# Altium schematic sheet IMX8_PHY.SchDoc
size 594 x 420 mm; SheetNumber: 9; SheetTotal: 20
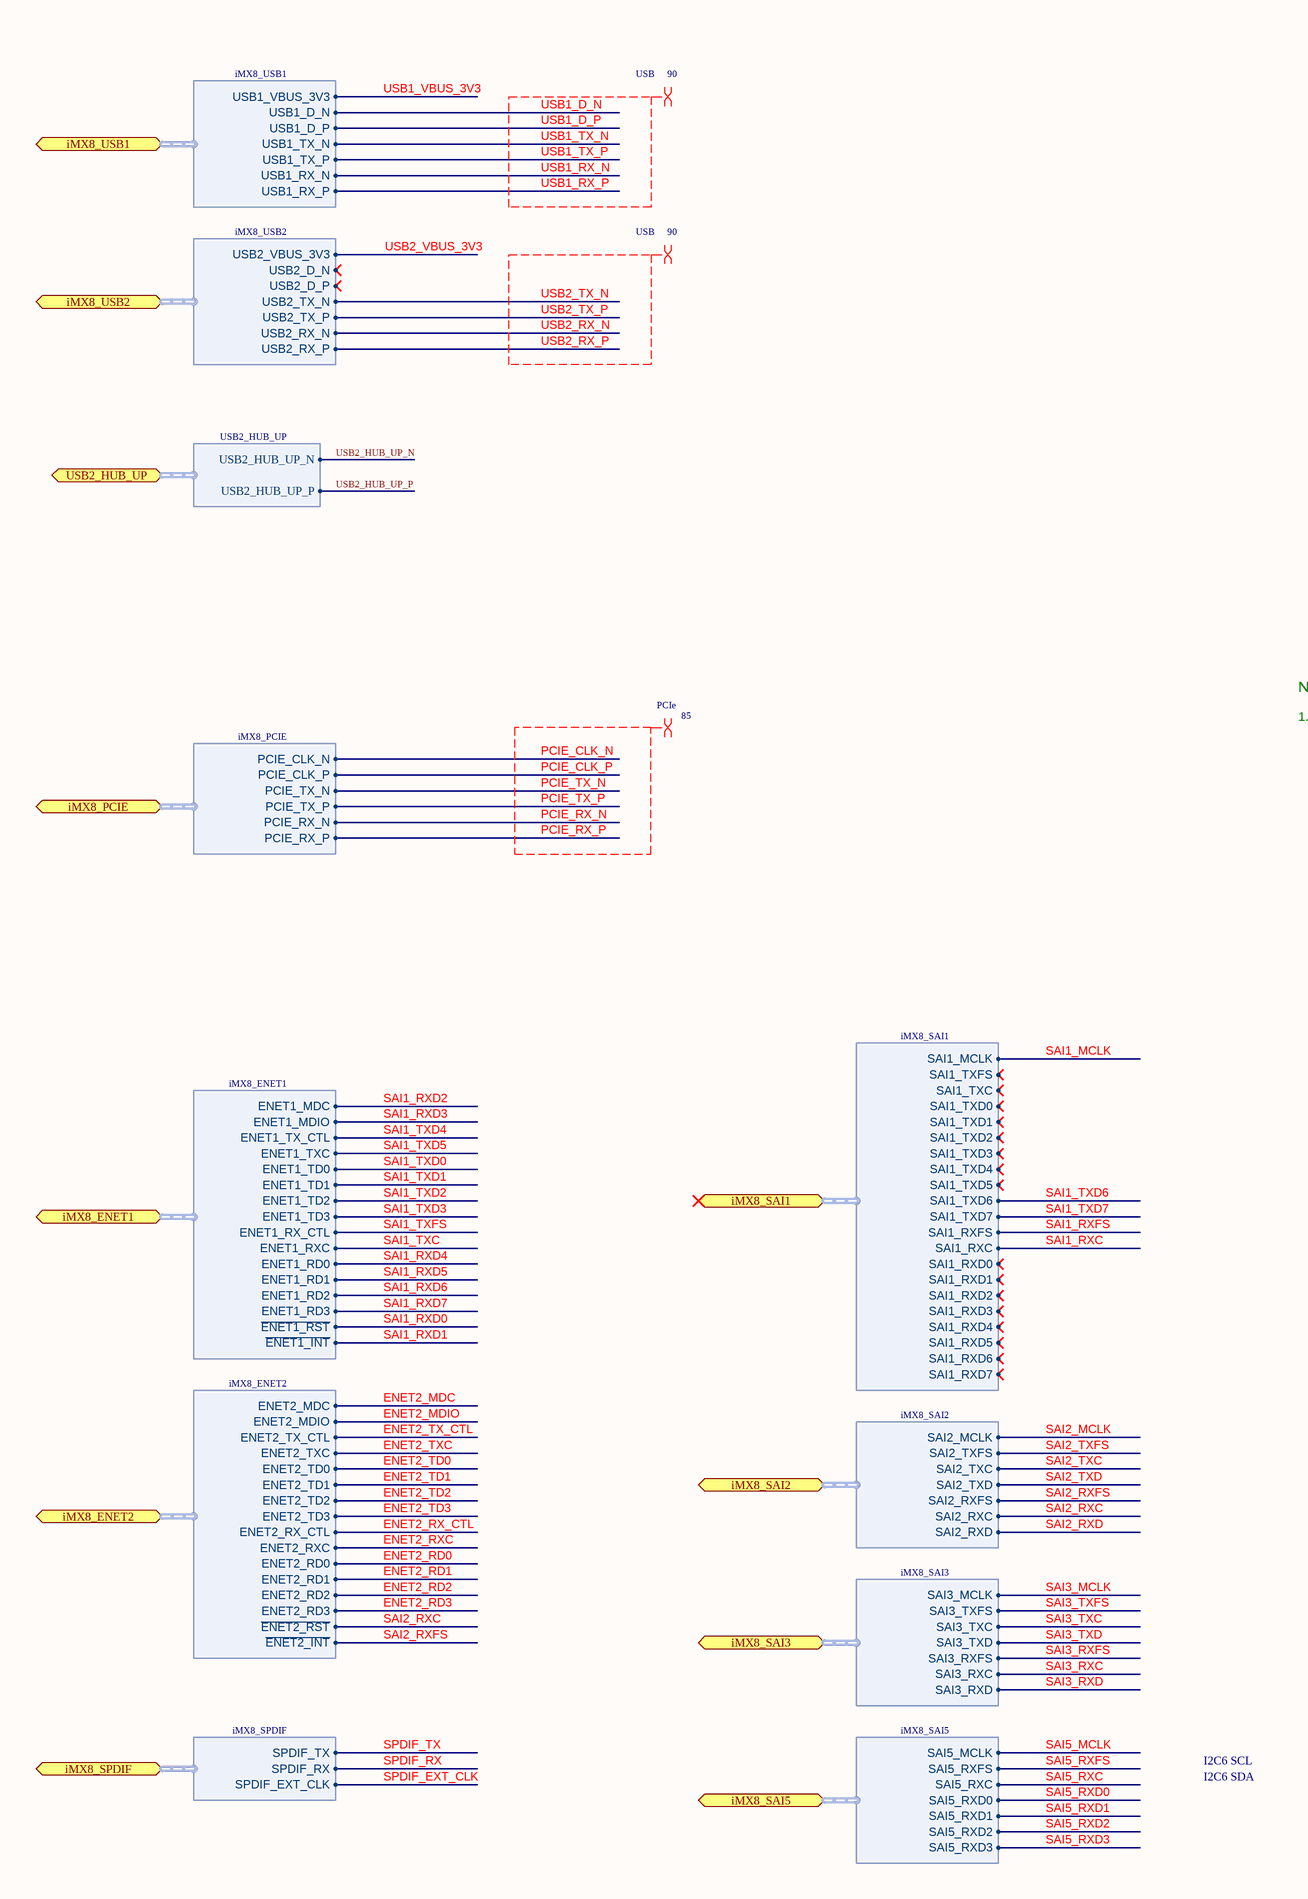
[diagram p0: IMX8_PHY.SchDoc, left]
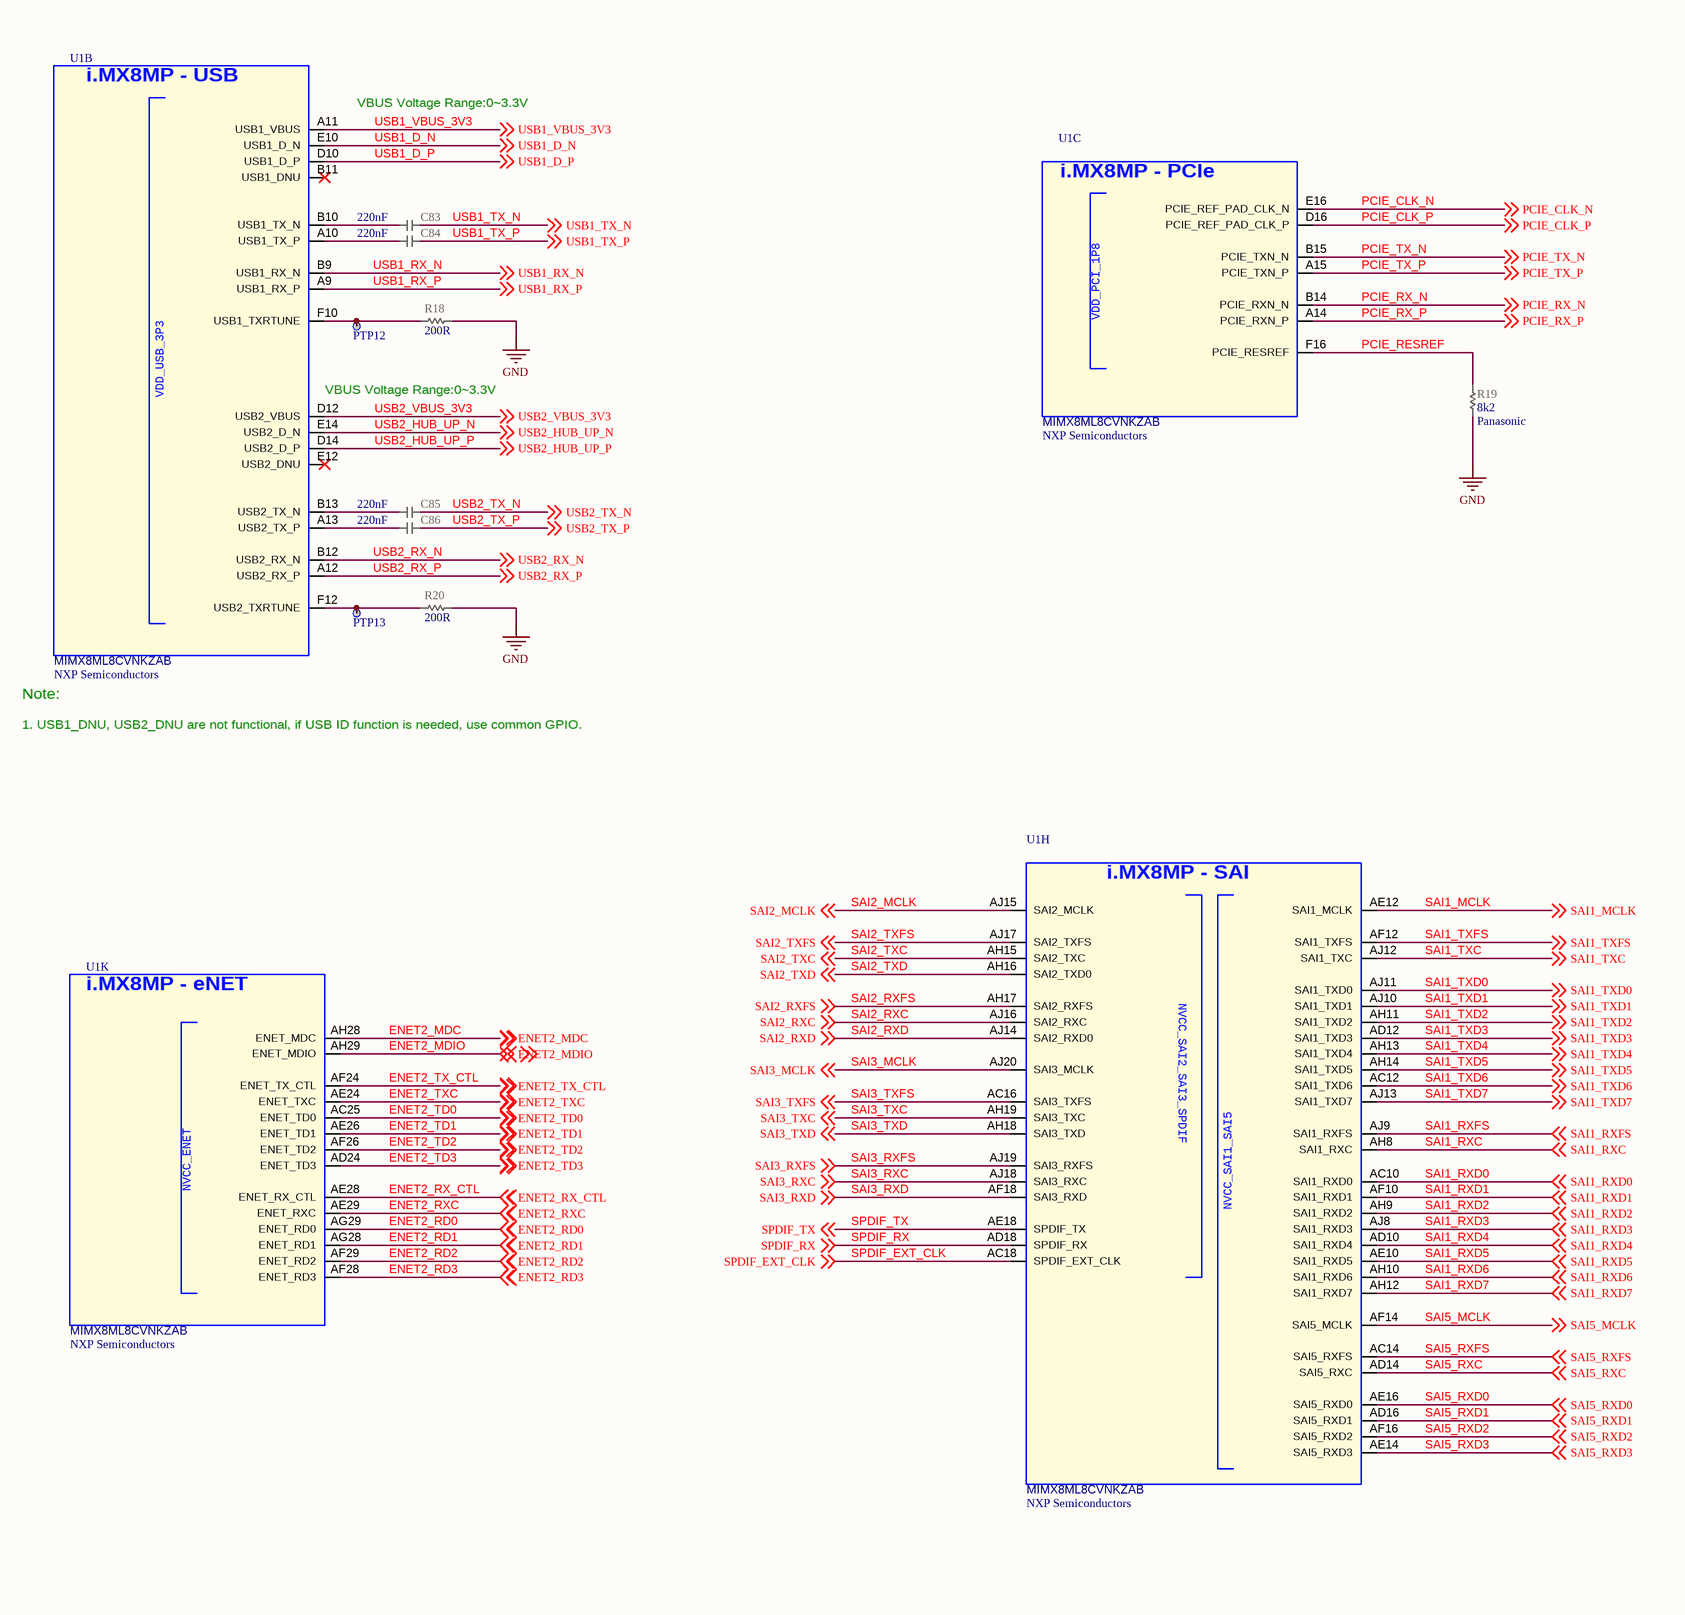
[diagram p1: IMX8_PHY.SchDoc, right]

## Parts
C83  value 220nF  [CAP_0201_UN1Q]  (hidden comment: CAP_0201_220n_10V_X6S)
C84  value 220nF  [CAP_0201_UN1Q]  (hidden comment: CAP_0201_220n_10V_X6S)
C85  value 220nF  [CAP_0201_UN1Q]  (hidden comment: CAP_0201_220n_10V_X6S)
C86  value 220nF  [CAP_0201_UN1Q]  (hidden comment: CAP_0201_220n_10V_X6S)
PTP12  PTP_0.4mm  [PTP_0.4mm]  (value not drawn)  (no BOM)
PTP13  PTP_0.4mm  [PTP_0.4mm]  (value not drawn)  (no BOM)
R18  value 200R  [RES_0201_UN1Q]  (hidden comment: RES_0201_200R)
R19  value 8k2  Manufacturer: Panasonic  [RES_0201_UN1Q]  (hidden comment: RES_0201_8k2)
R20  value 200R  [RES_0201_UN1Q]  (hidden comment: RES_0201_200R)
U1  Manufacturer: NXP Semiconductors  [BGA548C50P29X29_1500X1500X148]  (hidden comment: MIMX8ML8CVNKZAB)  (parts B,C,H,K of 15)

## Ports
iMX8_ENET1 (bidir, harness iMX8_ENET1), iMX8_ENET2 (bidir, harness iMX8_ENET2), iMX8_PCIE (bidir, harness iMX8_PCIE), iMX8_SAI1 (bidir, harness iMX8_SAI1), iMX8_SAI2 (bidir, harness iMX8_SAI2), iMX8_SAI3 (bidir, harness iMX8_SAI3), iMX8_SAI5 (bidir, harness iMX8_SAI5), iMX8_SPDIF (bidir, harness iMX8_SPDIF), iMX8_USB1 (bidir, harness iMX8_USB1), iMX8_USB2 (bidir, harness iMX8_USB2), USB2_HUB_UP (bidir, harness USB2_HUB_UP)

## Harnesses
iMX8_USB1: USB1_VBUS_3V3, USB1_D_N, USB1_D_P, USB1_TX_N, USB1_TX_P, USB1_RX_N, USB1_RX_P
iMX8_USB2: USB2_VBUS_3V3, USB2_D_N, USB2_D_P, USB2_TX_N, USB2_TX_P, USB2_RX_N, USB2_RX_P
USB2_HUB_UP: USB2_HUB_UP_P, USB2_HUB_UP_N
iMX8_ENET1: ENET1_MDC, ENET1_MDIO, ENET1_TX_CTL, ENET1_TXC, ENET1_TD0, ENET1_TD1, ENET1_TD2, ENET1_TD3, ENET1_RX_CTL, ENET1_RXC, ENET1_RD0, ENET1_RD1, ENET1_RD2, ENET1_RD3, ~{ENET1_RST}, ~{ENET1_INT}
iMX8_ENET2: ENET2_MDC, ENET2_MDIO, ENET2_TX_CTL, ENET2_TXC, ENET2_TD0, ENET2_TD1, ENET2_TD2, ENET2_TD3, ENET2_RX_CTL, ENET2_RXC, ENET2_RD0, ENET2_RD1, ENET2_RD2, ENET2_RD3, ~{ENET2_RST}, ~{ENET2_INT}
iMX8_PCIE: PCIE_CLK_N, PCIE_CLK_P, PCIE_TX_N, PCIE_TX_P, PCIE_RX_N, PCIE_RX_P
iMX8_SPDIF: SPDIF_TX, SPDIF_RX, SPDIF_EXT_CLK
iMX8_SAI2: SAI2_MCLK, SAI2_TXFS, SAI2_TXC, SAI2_TXD, SAI2_RXFS, SAI2_RXC, SAI2_RXD
iMX8_SAI3: SAI3_MCLK, SAI3_TXFS, SAI3_TXC, SAI3_TXD, SAI3_RXFS, SAI3_RXC, SAI3_RXD
iMX8_SAI5: SAI5_MCLK, SAI5_RXFS, SAI5_RXC, SAI5_RXD0, SAI5_RXD1, SAI5_RXD2, SAI5_RXD3
iMX8_SAI1: SAI1_MCLK, SAI1_TXFS, SAI1_TXC, SAI1_TXD0, SAI1_TXD1, SAI1_TXD2, SAI1_TXD3, SAI1_TXD4, SAI1_TXD5, SAI1_TXD6, SAI1_TXD7, SAI1_RXFS, SAI1_RXC, SAI1_RXD0, SAI1_RXD1, SAI1_RXD2, SAI1_RXD3, SAI1_RXD4, SAI1_RXD5, SAI1_RXD6, SAI1_RXD7

## Nets
GND: R18.1 R19.1 R20.1
ENET2_MDC: U1.AH28(ENET_MDC) ; off-sheet ENET2_MDC, port iMX8_ENET2.ENET2_MDC
ENET2_MDIO: U1.AH29(ENET_MDIO) ; off-sheet ENET2_MDIO, port iMX8_ENET2.ENET2_MDIO
ENET2_RD0: U1.AG29(ENET_RD0) ; off-sheet ENET2_RD0, port iMX8_ENET2.ENET2_RD0
ENET2_RD1: U1.AG28(ENET_RD1) ; off-sheet ENET2_RD1, port iMX8_ENET2.ENET2_RD1
ENET2_RD2: U1.AF29(ENET_RD2) ; off-sheet ENET2_RD2, port iMX8_ENET2.ENET2_RD2
ENET2_RD3: U1.AF28(ENET_RD3) ; off-sheet ENET2_RD3, port iMX8_ENET2.ENET2_RD3
ENET2_RX_CTL: U1.AE28(ENET_RX_CTL) ; off-sheet ENET2_RX_CTL, port iMX8_ENET2.ENET2_RX_CTL
ENET2_RXC: U1.AE29(ENET_RXC) ; off-sheet ENET2_RXC, port iMX8_ENET2.ENET2_RXC
ENET2_TD0: U1.AC25(ENET_TD0) ; off-sheet ENET2_TD0, port iMX8_ENET2.ENET2_TD0
ENET2_TD1: U1.AE26(ENET_TD1) ; off-sheet ENET2_TD1, port iMX8_ENET2.ENET2_TD1
ENET2_TD2: U1.AF26(ENET_TD2) ; off-sheet ENET2_TD2, port iMX8_ENET2.ENET2_TD2
ENET2_TD3: U1.AD24(ENET_TD3) ; off-sheet ENET2_TD3, port iMX8_ENET2.ENET2_TD3
ENET2_TX_CTL: U1.AF24(ENET_TX_CTL) ; off-sheet ENET2_TX_CTL, port iMX8_ENET2.ENET2_TX_CTL
ENET2_TXC: U1.AE24(ENET_TXC) ; off-sheet ENET2_TXC, port iMX8_ENET2.ENET2_TXC
PCIE_CLK_N: U1.E16(PCIE_REF_PAD_CLK_N) ; off-sheet PCIE_CLK_N, port iMX8_PCIE.PCIE_CLK_N
PCIE_CLK_P: U1.D16(PCIE_REF_PAD_CLK_P) ; off-sheet PCIE_CLK_P, port iMX8_PCIE.PCIE_CLK_P
PCIE_RESREF: R19.2 U1.F16(PCIE_RESREF)
PCIE_RX_N: U1.B14(PCIE_RXN_N) ; off-sheet PCIE_RX_N, port iMX8_PCIE.PCIE_RX_N
PCIE_RX_P: U1.A14(PCIE_RXN_P) ; off-sheet PCIE_RX_P, port iMX8_PCIE.PCIE_RX_P
PCIE_TX_N: U1.B15(PCIE_TXN_N) ; off-sheet PCIE_TX_N, port iMX8_PCIE.PCIE_TX_N
PCIE_TX_P: U1.A15(PCIE_TXN_P) ; off-sheet PCIE_TX_P, port iMX8_PCIE.PCIE_TX_P
SAI1_MCLK: U1.AE12(SAI1_MCLK) ; off-sheet SAI1_MCLK, port iMX8_SAI1.SAI1_MCLK
SAI1_RXC: U1.AH8(SAI1_RXC) ; off-sheet SAI1_RXC, port iMX8_SAI1.SAI1_RXC
SAI1_RXD0: U1.AC10(SAI1_RXD0) ; off-sheet SAI1_RXD0, port iMX8_ENET1.~{ENET1_RST}
SAI1_RXD1: U1.AF10(SAI1_RXD1) ; off-sheet SAI1_RXD1, port iMX8_ENET1.~{ENET1_INT}
SAI1_RXD2: U1.AH9(SAI1_RXD2) ; off-sheet SAI1_RXD2, port iMX8_ENET1.ENET1_MDC
SAI1_RXD3: U1.AJ8(SAI1_RXD3) ; off-sheet SAI1_RXD3, port iMX8_ENET1.ENET1_MDIO
SAI1_RXD4: U1.AD10(SAI1_RXD4) ; off-sheet SAI1_RXD4, port iMX8_ENET1.ENET1_RD0
SAI1_RXD5: U1.AE10(SAI1_RXD5) ; off-sheet SAI1_RXD5, port iMX8_ENET1.ENET1_RD1
SAI1_RXD6: U1.AH10(SAI1_RXD6) ; off-sheet SAI1_RXD6, port iMX8_ENET1.ENET1_RD2
SAI1_RXD7: U1.AH12(SAI1_RXD7) ; off-sheet SAI1_RXD7, port iMX8_ENET1.ENET1_RD3
SAI1_RXFS: U1.AJ9(SAI1_RXFS) ; off-sheet SAI1_RXFS, port iMX8_SAI1.SAI1_RXFS
SAI1_TXC: U1.AJ12(SAI1_TXC) ; off-sheet SAI1_TXC, port iMX8_ENET1.ENET1_RXC
SAI1_TXD0: U1.AJ11(SAI1_TXD0) ; off-sheet SAI1_TXD0, port iMX8_ENET1.ENET1_TD0
SAI1_TXD1: U1.AJ10(SAI1_TXD1) ; off-sheet SAI1_TXD1, port iMX8_ENET1.ENET1_TD1
SAI1_TXD2: U1.AH11(SAI1_TXD2) ; off-sheet SAI1_TXD2, port iMX8_ENET1.ENET1_TD2
SAI1_TXD3: U1.AD12(SAI1_TXD3) ; off-sheet SAI1_TXD3, port iMX8_ENET1.ENET1_TD3
SAI1_TXD4: U1.AH13(SAI1_TXD4) ; off-sheet SAI1_TXD4, port iMX8_ENET1.ENET1_TX_CTL
SAI1_TXD5: U1.AH14(SAI1_TXD5) ; off-sheet SAI1_TXD5, port iMX8_ENET1.ENET1_TXC
SAI1_TXD6: U1.AC12(SAI1_TXD6) ; off-sheet SAI1_TXD6, port iMX8_SAI1.SAI1_TXD6
SAI1_TXD7: U1.AJ13(SAI1_TXD7) ; off-sheet SAI1_TXD7, port iMX8_SAI1.SAI1_TXD7
SAI1_TXFS: U1.AF12(SAI1_TXFS) ; off-sheet SAI1_TXFS, port iMX8_ENET1.ENET1_RX_CTL
SAI2_MCLK: U1.AJ15(SAI2_MCLK) ; off-sheet SAI2_MCLK, port iMX8_SAI2.SAI2_MCLK
SAI2_RXC: U1.AJ16(SAI2_RXC) ; off-sheet SAI2_RXC, port iMX8_ENET2.~{ENET2_RST}, port iMX8_SAI2.SAI2_RXC
SAI2_RXD: U1.AJ14(SAI2_RXD0) ; off-sheet SAI2_RXD, port iMX8_SAI2.SAI2_RXD
SAI2_RXFS: U1.AH17(SAI2_RXFS) ; off-sheet SAI2_RXFS, port iMX8_ENET2.~{ENET2_INT}, port iMX8_SAI2.SAI2_RXFS
SAI2_TXC: U1.AH15(SAI2_TXC) ; off-sheet SAI2_TXC, port iMX8_SAI2.SAI2_TXC
SAI2_TXD: U1.AH16(SAI2_TXD0) ; off-sheet SAI2_TXD, port iMX8_SAI2.SAI2_TXD
SAI2_TXFS: U1.AJ17(SAI2_TXFS) ; off-sheet SAI2_TXFS, port iMX8_SAI2.SAI2_TXFS
SAI3_MCLK: U1.AJ20(SAI3_MCLK) ; off-sheet SAI3_MCLK, port iMX8_SAI3.SAI3_MCLK
SAI3_RXC: U1.AJ18(SAI3_RXC) ; off-sheet SAI3_RXC, port iMX8_SAI3.SAI3_RXC
SAI3_RXD: U1.AF18(SAI3_RXD) ; off-sheet SAI3_RXD, port iMX8_SAI3.SAI3_RXD
SAI3_RXFS: U1.AJ19(SAI3_RXFS) ; off-sheet SAI3_RXFS, port iMX8_SAI3.SAI3_RXFS
SAI3_TXC: U1.AH19(SAI3_TXC) ; off-sheet SAI3_TXC, port iMX8_SAI3.SAI3_TXC
SAI3_TXD: U1.AH18(SAI3_TXD) ; off-sheet SAI3_TXD, port iMX8_SAI3.SAI3_TXD
SAI3_TXFS: U1.AC16(SAI3_TXFS) ; off-sheet SAI3_TXFS, port iMX8_SAI3.SAI3_TXFS
SAI5_MCLK: U1.AF14(SAI5_MCLK) ; off-sheet SAI5_MCLK, port iMX8_SAI5.SAI5_MCLK
SAI5_RXC: U1.AD14(SAI5_RXC) ; off-sheet SAI5_RXC, port iMX8_SAI5.SAI5_RXC
SAI5_RXD0: U1.AE16(SAI5_RXD0) ; off-sheet SAI5_RXD0, port iMX8_SAI5.SAI5_RXD0
SAI5_RXD1: U1.AD16(SAI5_RXD1) ; off-sheet SAI5_RXD1, port iMX8_SAI5.SAI5_RXD1
SAI5_RXD2: U1.AF16(SAI5_RXD2) ; off-sheet SAI5_RXD2, port iMX8_SAI5.SAI5_RXD2
SAI5_RXD3: U1.AE14(SAI5_RXD3) ; off-sheet SAI5_RXD3, port iMX8_SAI5.SAI5_RXD3
SAI5_RXFS: U1.AC14(SAI5_RXFS) ; off-sheet SAI5_RXFS, port iMX8_SAI5.SAI5_RXFS
SPDIF_EXT_CLK: U1.AC18(SPDIF_EXT_CLK) ; off-sheet SPDIF_EXT_CLK, port iMX8_SPDIF.SPDIF_EXT_CLK
SPDIF_RX: U1.AD18(SPDIF_RX) ; off-sheet SPDIF_RX, port iMX8_SPDIF.SPDIF_RX
SPDIF_TX: U1.AE18(SPDIF_TX) ; off-sheet SPDIF_TX, port iMX8_SPDIF.SPDIF_TX
USB1_D_N: U1.E10(USB1_D_N) ; off-sheet USB1_D_N, port iMX8_USB1.USB1_D_N
USB1_D_P: U1.D10(USB1_D_P) ; off-sheet USB1_D_P, port iMX8_USB1.USB1_D_P
USB1_RX_N: U1.B9(USB1_RX_N) ; off-sheet USB1_RX_N, port iMX8_USB1.USB1_RX_N
USB1_RX_P: U1.A9(USB1_RX_P) ; off-sheet USB1_RX_P, port iMX8_USB1.USB1_RX_P
USB1_TX_N: C83.1 ; off-sheet USB1_TX_N, port iMX8_USB1.USB1_TX_N
USB1_TX_P: C84.1 ; off-sheet USB1_TX_P, port iMX8_USB1.USB1_TX_P
USB1_VBUS_3V3: U1.A11(USB1_VBUS) ; off-sheet USB1_VBUS_3V3, port iMX8_USB1.USB1_VBUS_3V3
USB2_HUB_UP_N: U1.E14(USB2_D_N) ; off-sheet USB2_HUB_UP_N, port USB2_HUB_UP.USB2_HUB_UP_N
USB2_HUB_UP_P: U1.D14(USB2_D_P) ; off-sheet USB2_HUB_UP_P, port USB2_HUB_UP.USB2_HUB_UP_P
USB2_RX_N: U1.B12(USB2_RX_N) ; off-sheet USB2_RX_N, port iMX8_USB2.USB2_RX_N
USB2_RX_P: U1.A12(USB2_RX_P) ; off-sheet USB2_RX_P, port iMX8_USB2.USB2_RX_P
USB2_TX_N: C85.1 ; off-sheet USB2_TX_N, port iMX8_USB2.USB2_TX_N
USB2_TX_P: C86.1 ; off-sheet USB2_TX_P, port iMX8_USB2.USB2_TX_P
USB2_VBUS_3V3: U1.D12(USB2_VBUS) ; off-sheet USB2_VBUS_3V3, port iMX8_USB2.USB2_VBUS_3V3
NetC83_2: C83.2 U1.B10(USB1_TX_N)
NetC84_2: C84.2 U1.A10(USB1_TX_P)
NetC85_2: C85.2 U1.B13(USB2_TX_N)
NetC86_2: C86.2 U1.A13(USB2_TX_P)
NetPTP12_1: PTP12.1(TP) R18.2 U1.F10(USB1_TXRTUNE)
NetPTP13_1: PTP13.1(TP) R20.2 U1.F12(USB2_TXRTUNE)

Not connected (* = marked no-connect by the designer): U1 B11(USB1_DNU)* E12(USB2_DNU)*

## Layout directives
differential pair; differential pair class 90; net class USB; rule Matched Net Lengths [Tolerance = 0.3mm]: USB1_D_N, USB1_D_P, USB1_RX_N, USB1_RX_P, USB1_TX_N, USB1_TX_P, USB2_RX_N, USB2_RX_P, USB2_TX_N, USB2_TX_P
differential pair; net class PCIe; rule Matched Net Lengths [Tolerance = 0.1mm]; differential pair class 85: PCIE_CLK_N, PCIE_CLK_P, PCIE_RX_N, PCIE_RX_P, PCIE_TX_N, PCIE_TX_P

## Notes on the sheet
- (near U1) VBUS Voltage Range:0~3.3V
- 1. USB1_DNU, USB2_DNU are not functional, if USB ID function is needed, use common GPIO.
- Note:
- I2C6 SDA
- I2C6 SCL
- DWG NO:
- REV:
- THIS DOCUMENT AND THE DATA DISCLOSED HEREIN OR
- HEREWITH IS THE PROPERTY OF ALTIUM LIMITED AND MAY
- BE FREELY DISTRIBUTED IN WHOLE. NO RIGHTS ARE
- RESERVED OR EXPRESS OR IMPLIED WARANTEE GIVEN.
- REVISION
- DESCRIPTION
- DATE
- APPROVED
- ENG:
- APPROVALS
- PROJECT
- DSN:
- CHK:
- REFERENCE DOCUMENTS
- PROJECT REVISION:
- TITLE
- DOCUMENT REVISION:
- DESIGN ITEM:
- BOM:
- FAB DWG:
- PCB DWG:
- ASSY DWG:
- SCALE:
- A2
- SIZE
- CAGE CODE
- FILE NAME
- DWG NO.
- SHEET
- OF
- REV
- (in symbol CMP-001-000983-8, part B) i.MX8MP - USB
- (in symbol CMP-001-000983-8, part C) i.MX8MP - PCIe
- (in symbol CMP-001-000983-8, part H) i.MX8MP - SAI
- (in symbol CMP-001-000983-8, part K) i.MX8MP - eNET

## Library data of the parts
C83-C86 = CMP-001-000889-11: CAP; Part Number: GRM033C81A224KE01D; Manufacturer: Murata; Temperature characteristics: X6S; Voltage: 10V; Tolerance: +/-20%; Sort order: 302; HasBeenBuilt: TBD; Alternative component: Allowed; System: RLC; Package: 0201; Dimensions WxLxH: 0.35; ComponentLink1Description: 1_Datasheet; ComponentLink2Description: 2_Product page; ComponentLink3Description: 3_X-information; ComponentLink4Description: 4_X-information; Creation date: 26042024; ClassName: SMALL
PTP12 PTP13 = CMP-001-001296-3: Production Testpoint 0.4mm. Flying probe. Use 1mm pitch.; ComponentLink4Description: 4_X-information; ComponentLink1Description: 1_Datasheet; Part Number: PTP 0.4mm; Sort order: -; ClassName: SMALL; System: Test Point; HasBeenBuilt: -; Design Item ID: PTP_0.4mm; ComponentLink3Description: 3_X-information; Creation date: 20240909; ComponentLink2Description: 2_Product page
R18 R20 = CMP-001-000549-13: RES; Part Number: CRCW0201200RFNED; Manufacturer: Vishay Dale; Tolerance: 1%; Power Rating: 1/20W; Sort order: 322; HasBeenBuilt: TBD; Alternative component: Allowed; System: RLC; Package: 0201; ClassName: SMALL; ComponentLink1Description: 1_Datasheet; ComponentLink2Description: 2_Product page; ComponentLink3Description: 3_X-information; ComponentLink4Description: 4_X-information; Creation date: 20190101; Source: RLC_UN1Q.SchLib
R19 = CMP-001-001255-9: RES; Part Number: ERJ1GNF8201C; Manufacturer: Panasonic Electronic Components; Tolerance: 1%; Power Rating: 1/20W; Sort order: 322; Alternative component: Allowed; System: RLC; Package: 0201; ClassName: SMALL; ComponentLink1Description: 1_Datasheet; ComponentLink2Description: 2_Product page; ComponentLink3Description: 3_X-information; ComponentLink4Description: 4_X-information; Creation date: 20240404; Manufacturer Part Number: ERJ1GNF8201C; Component Type: Resistor
U1 = CMP-001-000983-8: CPU QUAD CORTEX A53+M4 1.6GHZ BGA548 Industrial; Sort order: 501; System: IC; ComponentLink1Description: 1_Datasheet; ComponentLink1URL: https://www.nxp.com/part/MIMX8ML8CVNKZAB#/; ComponentLink2Description: 2_Product page; ComponentLink3Description: 3_X-information; ComponentLink4Description: 4_X-information; Creation date: 20240524; Dimensions WxLxH: 15 x 15 x 1.33mm; Manufacturer: NXP SEMICONDUCTORS; Operating temperature range: -40... +105 °C; Package: FCBGA548; Part Number: MIMX8ML8CVNKZAB; ClassName: BIG; Source: UUDET_KOMPONENTIT.SchLib; Design Item ID: MIMX8ML8CVNKZAB; Manufacturer Part Number: MIMX8ML8CVNKZAB; Component Type: Processor